# EAGLE schematic Havoc (EAGLE 6.4)
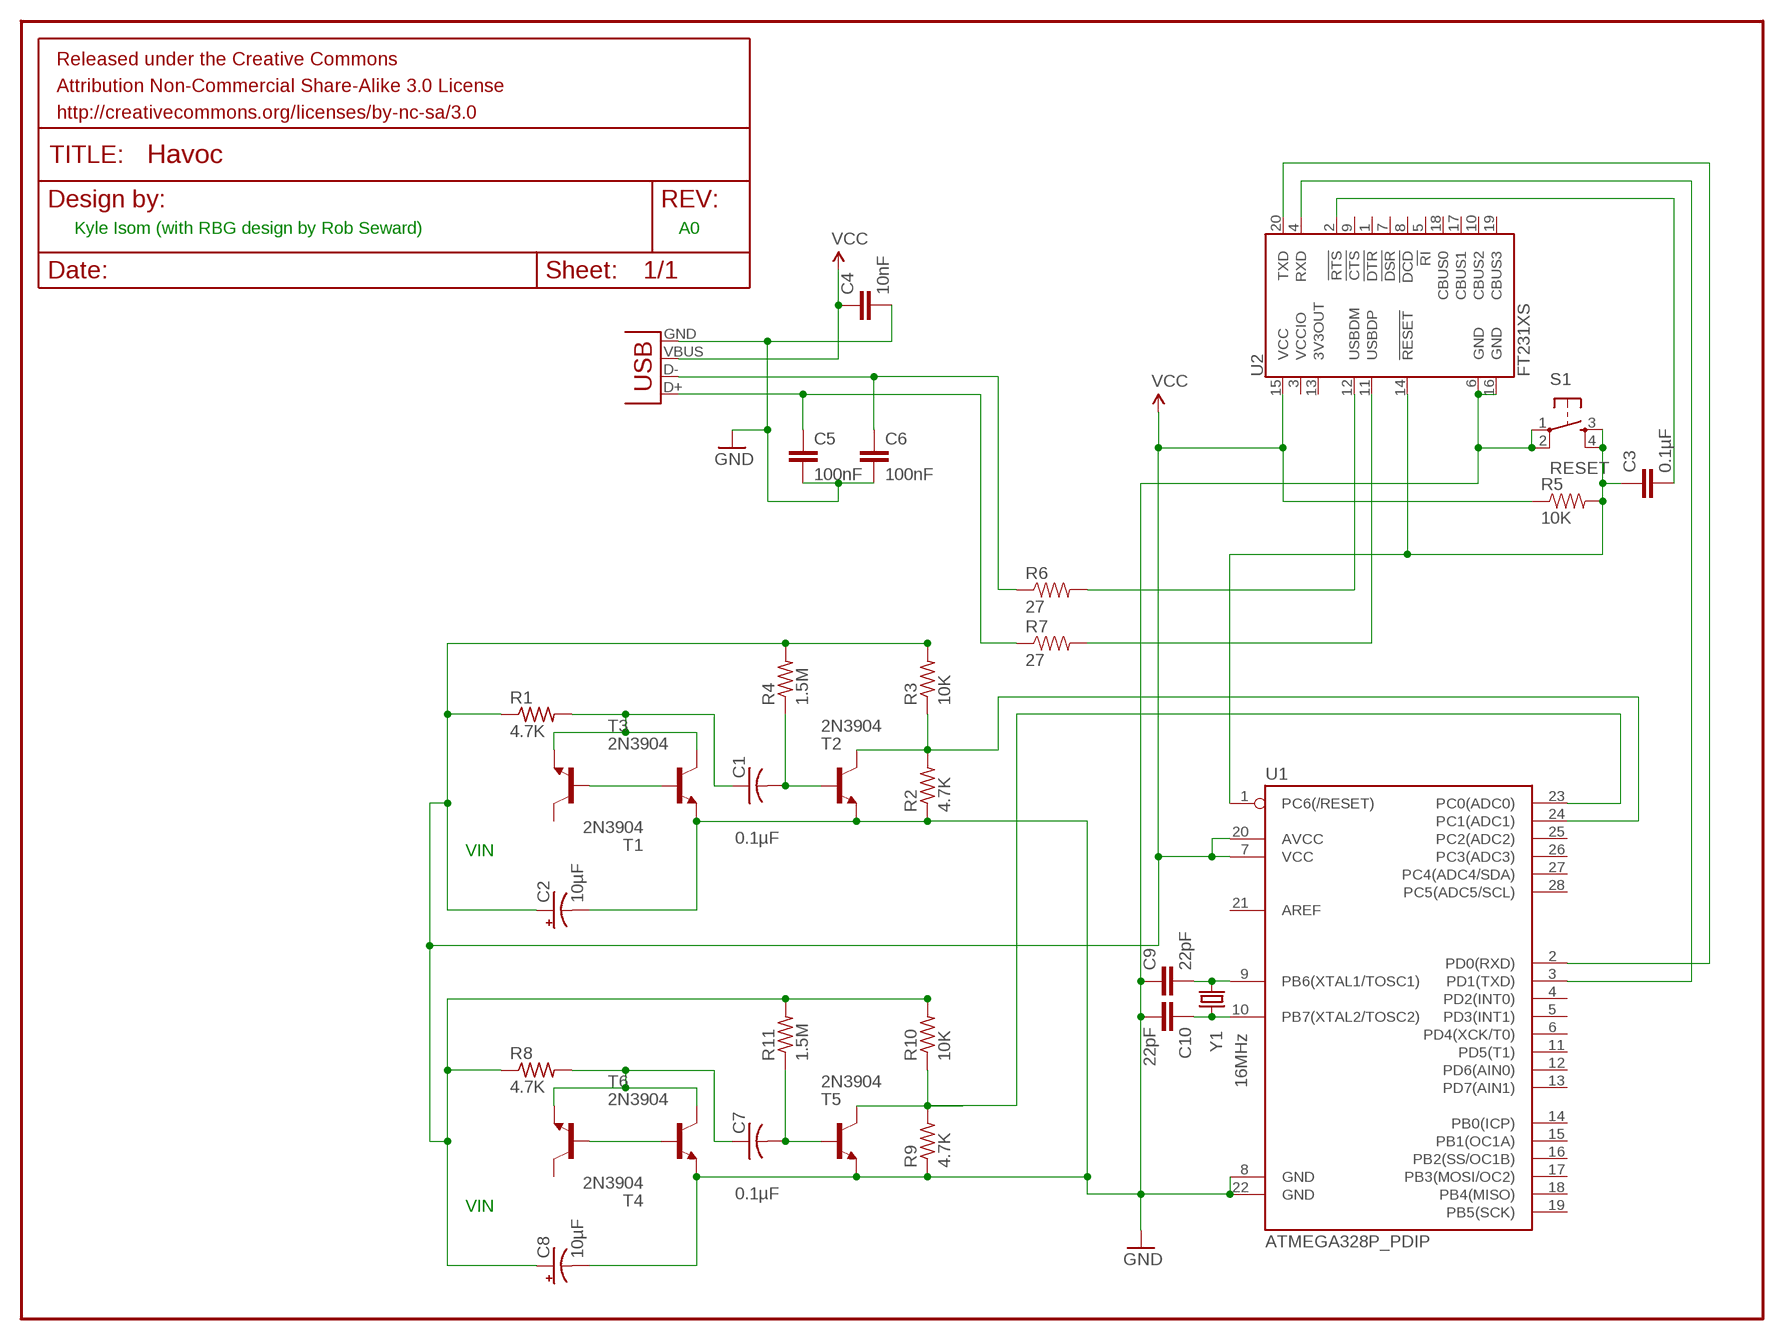
[diagram p0: schematic, sheet 1]

## Parts
C1  0.1µF  C-US050-030X075  [C050-030X075]
C2  10µF  CPOL-USE2-5  [E2-5]
C3  0.1µF  CAPPTH  [CAP-PTH-SMALL]
C4  10nF  CAPPTH  [CAP-PTH-SMALL]
C5  100nF  CAPPTH  [CAP-PTH-SMALL]
C6  100nF  CAPPTH  [CAP-PTH-SMALL]
C7  0.1µF  C-US050-030X075  [C050-030X075]
C8  10µF  CPOL-USE2-5  [E2-5]
C9  22pF  CAPPTH  [CAP-PTH-SMALL]
C10  22pF  CAPPTH  [CAP-PTH-SMALL]
FRAME1  FRAME-LETTER  [CREATIVE_COMMONS]
JP1  USBSMD  [USB-MINIB]
R1  4.7K  R-US_0207/7  [0207/7]
R2  4.7K  R-US_0207/7  [0207/7]
R3  10K  R-US_0207/7  [0207/7]
R4  1.5M  R-US_0207/7  [0207/7]
R5  10K  RESISTORPTH-1W  [AXIAL-0.6]
R6  27  RESISTORPTH-1W  [AXIAL-0.6]
R7  27  RESISTORPTH-1W  [AXIAL-0.6]
R8  4.7K  R-US_0207/7  [0207/7]
R9  4.7K  R-US_0207/7  [0207/7]
R10  10K  R-US_0207/7  [0207/7]
R11  1.5M  R-US_0207/7  [0207/7]
S1  RESET  TAC_SWITCHPTH  [TACTILE-PTH]
T1  2N3904  [TO92]
T2  2N3904  [TO92]
T3  2N3904  [TO92]
T4  2N3904  [TO92]
T5  2N3904  [TO92]
T6  2N3904  [TO92]
U1  ATMEGA328P_PDIP  [DIL28-3]
U2  FT231XS  [SSOP20_L]
Y1  16MHz  CRYSTALHC49US  [HC49US]

## Nets
GND: C2.- C4.2 C5.2 C6.2 C8.- C9.1 C10.2 JP1.GND R2.1 R9.1 S1.1 S1.2 T2.3(E) T3.3(E) T5.3(E) T6.3(E) U1.8(GND) U1.22(GND) U2.6(GND) U2.16(GND)
N$1: C9.2 U1.9(PB6(XTAL1/TOSC1)) Y1.2
N$2: C10.1 U1.10(PB7(XTAL2/TOSC2)) Y1.1
N$3: T1.2(B) T3.2(B)
N$4: C1.1 R1.2 T1.3(E) T3.1(C)
N$5: C3.1 R5.P$2 S1.3 S1.4 U1.1(PC6(/RESET)) U2.14(!RESET)
N$6: C3.2 U2.2(!RTS)
N$7: R2.2 R3.1 T2.1(C) U1.24(PC1(ADC1))
N$8: C1.2 R4.1 T2.2(B)
N$9: R6.P$2 U2.12(USBDM)
N$10: R7.P$2 U2.11(USBDP)
N$11: U1.3(PD1(TXD)) U2.4(RXD)
N$12: U1.2(PD0(RXD)) U2.20(TXD)
N$13: C6.1 JP1.D- R6.P$1
N$14: C5.1 JP1.D+ R7.P$1
N$17: T4.2(B) T6.2(B)
N$18: C7.1 R8.2 T4.3(E) T6.1(C)
N$19: R9.2 R10.1 T5.1(C) U1.23(PC0(ADC0))
N$20: C7.2 R11.1 T5.2(B)
VCC: C2.+ C4.1 C8.+ JP1.VBUS R1.1 R3.2 R4.2 R5.P$1 R8.1 R10.2 R11.2 U1.7(VCC) U1.20(AVCC) U2.15(VCC)
Unconnected: T1.1(C) T4.1(C) U1.4(PD2(INT0)) U1.5(PD3(INT1)) U1.6(PD4(XCK/T0)) U1.11(PD5(T1)) U1.12(PD6(AIN0)) U1.13(PD7(AIN1)) U1.14(PB0(ICP)) U1.15(PB1(OC1A)) U1.16(PB2(SS/OC1B)) U1.17(PB3(MOSI/OC2)) U1.18(PB4(MISO)) U1.19(PB5(SCK)) U1.21(AREF) U1.25(PC2(ADC2)) U1.26(PC3(ADC3)) U1.27(PC4(ADC4/SDA)) U1.28(PC5(ADC5/SCL)) U2.1(!DTR) U2.3(VCCIO) U2.5(!RI) U2.7(!DSR) U2.8(!DCD) U2.9(!CTS) U2.10(CBUS2) U2.13(3V3OUT) U2.17(CBUS1) U2.18(CBUS0) U2.19(CBUS3)

## Notes on the sheet
- Kyle Isom (with RBG design by Rob Seward) | A0
- VIN
- VIN

## Library data of the parts
C1 C7 = resistor:C-US: CAPACITOR, American symbol
C2 C8 = resistor:CPOL-US: POLARIZED CAPACITOR, American symbol
C3 C4 = SparkFun-Passives:CAP: Capacitor Standard 0603 ceramic capacitor, and 0.1" leaded capacitor.
C5 C6 C9 C10 = SparkFun-Capacitors:CAP: Capacitor Standard 0603 ceramic capacitor, and 0.1" leaded capacitor.
FRAME1 = Aesthetics:FRAME-LETTER: Schematic Frame Standard 8.5x11 US Letter frame
JP1 = SparkFun-Connectors:USB: USB Connectors USB-B-PTH is fully proven SKU : PRT-00139/CONN-08278 USB-miniB is fully proven SKU : PRT-00587 USB-A-PCB is untested. USB-A-H is throughly reviewed, but untested. Spark Fun Electronics SKU : PRT-00437 USB-B-SMT is throughly reviewed, but untested. Needs silkscreen touching up. USB-A-S has not been used/tested USB-MB-H has not been used/tested USB-MICROB has been used. CONN-09505
R1-R4 R8-R11 = resistor:R-US_: RESISTOR, American symbol
R5-R7 = SparkFun-Passives:RESISTOR: Resistor Basic schematic elements and footprints for 0603, 1206, and PTH resistors.
S1 = SparkFun-Electromechanical:TAC_SWITCH: Momentary Switch Button commonly used for reset or general input. Spark Fun Electronics SKU : COM-00097 SMT- SWCH-08247
T1-T6 = transistor:2N3904: NPN TRANSISTOR
U1 = SparkFun-DigitalIC:ATMEGA328P_PDIP: uC used in the Arduino 32kb flash, 1k EEPROM, 2k SRAM This is the through-hole version of this chip.
U2 = SparkFun-DigitalIC:FT231X: FTDI FT231X Full Speed USB to Full-handshake UART This USB2.0 Full Speed IC offers a compact bridge to full handshake UART interfaces. The device is a UART, capable of operating up to 3MBaud, with low power consumption (8mA). The FT231X includes the complete FT-X series feature set and enables USB to be added into a system design quickly and easily over a UART interface.
Y1 = SparkFun-FreqCtrl:CRYSTAL: Various standard crystals. Proven footprints. Spark Fun Electronics SKU : COM-00534